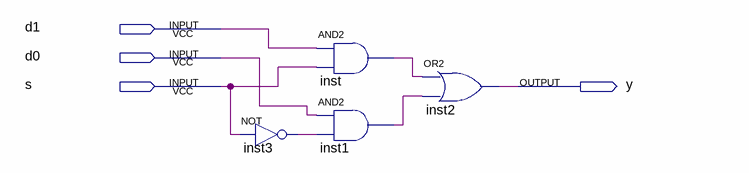
[diagram p0: schematic sheet]
// Quartus schematic mux21.bdf as structural Verilog: 4 symbols, 4 pins
module mux21 (
  input  d1,
  input  d0,
  input  s,
  output y
);

  wire inst1_out, inst3_out, inst_out;

  not inst3 (inst3_out, s);
  and inst (inst_out, d1, s);
  and inst1 (inst1_out, d0, inst3_out);
  or inst2 (y, inst_out, inst1_out);
endmodule
